# EAGLE design QC_MICRO_v0_2_without_teardrop (EAGLE 5.10)
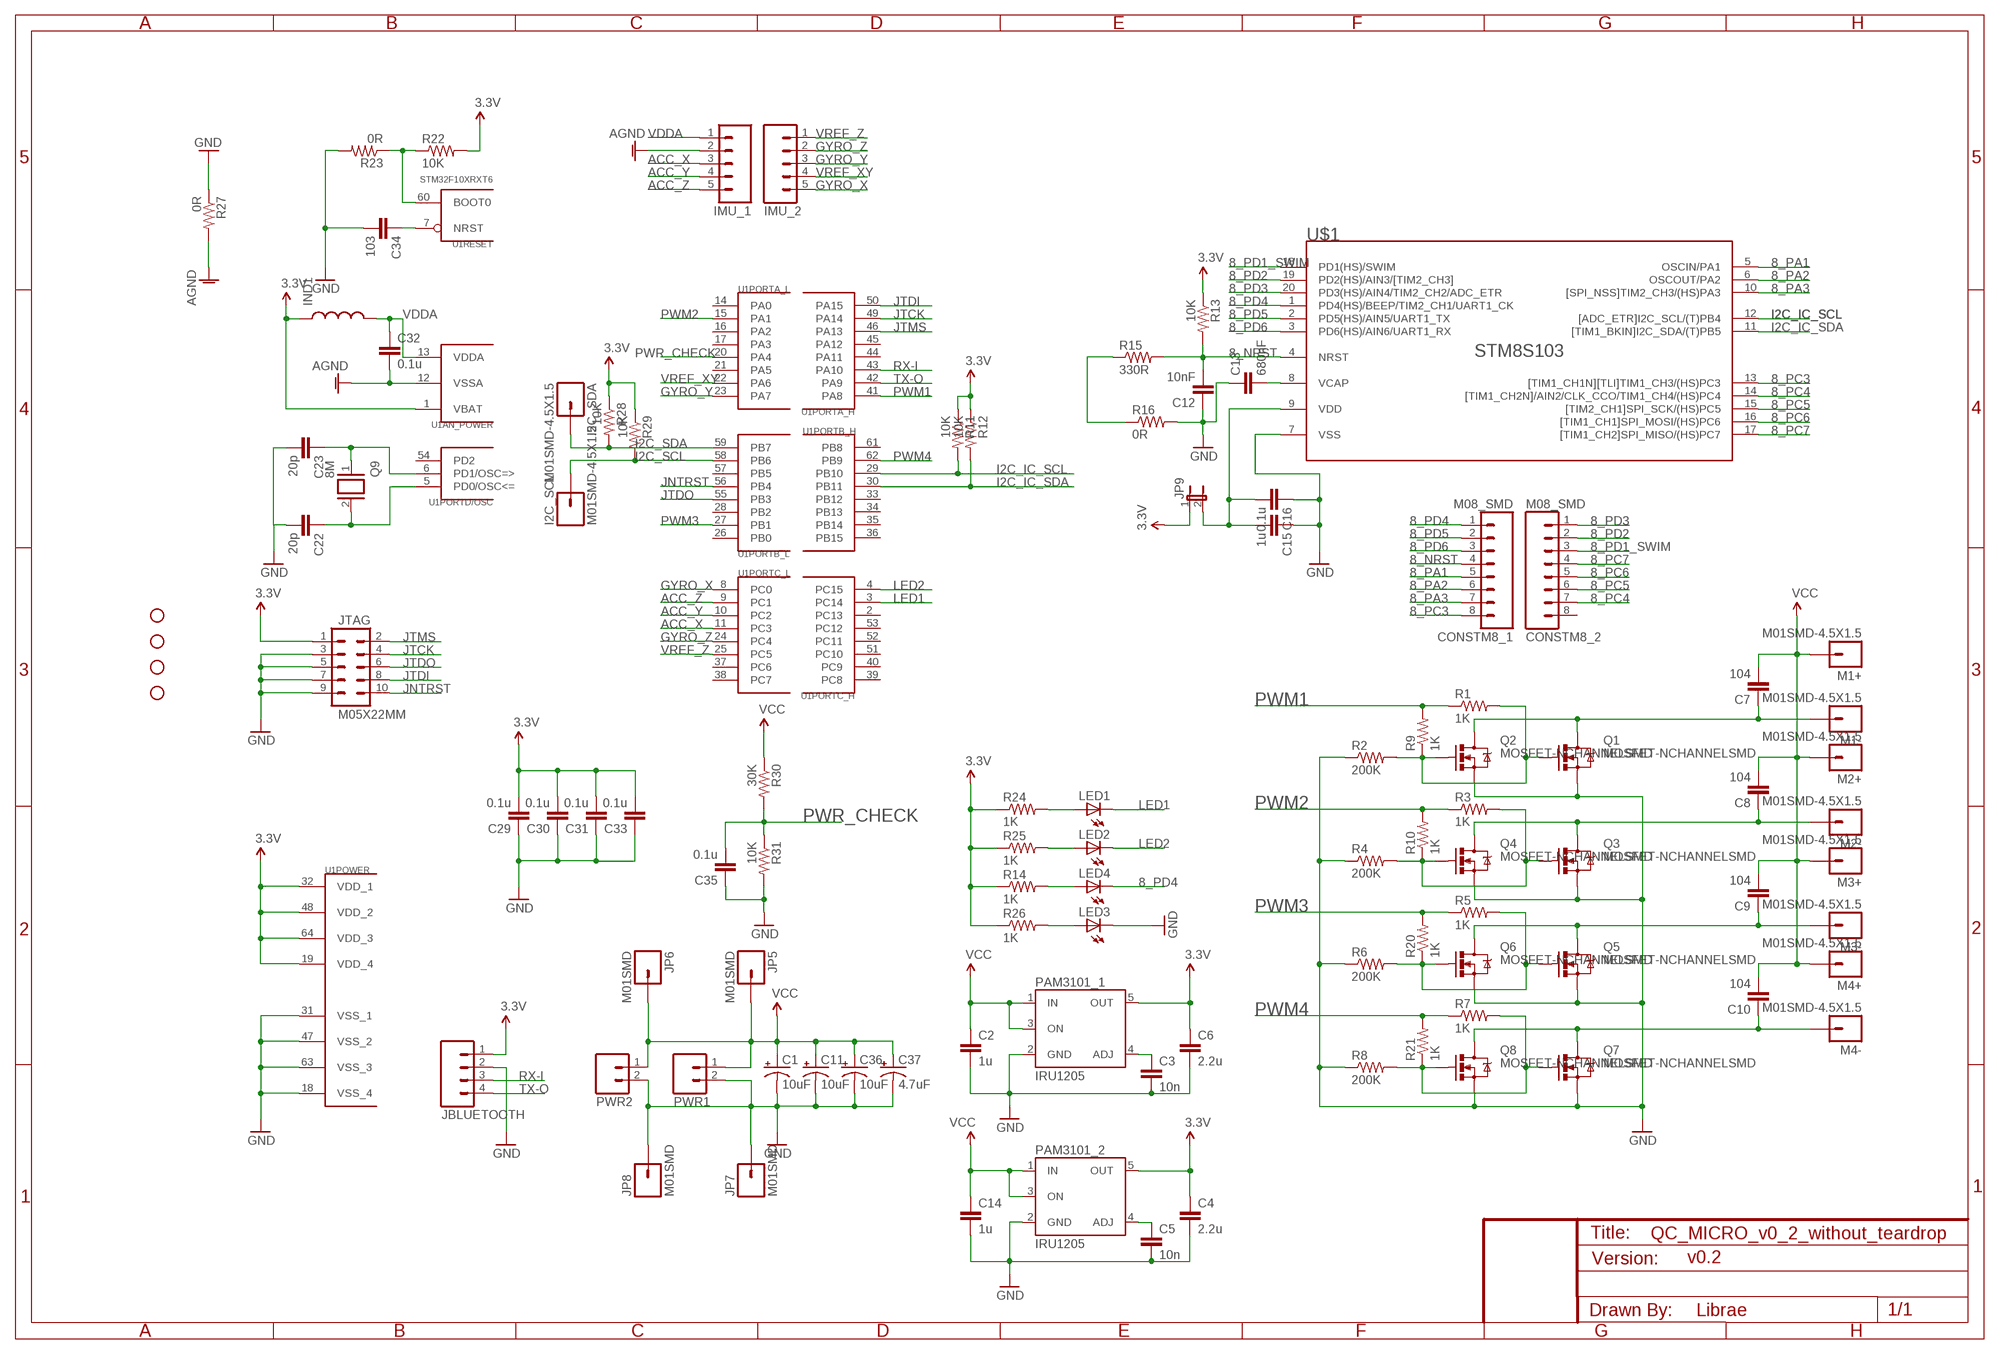
[diagram p0: schematic, sheet 1]

## Parts
C1  10uF  CAP_POL3528  [EIA3528]
C2  1u  CAP0603-CAP  [0603-CAP]
C3  10n  CAP0603-CAP  [0603-CAP]
C4  2.2u  CAP0603-CAP  [0603-CAP]
C5  10n  CAP0603-CAP  [0603-CAP]
C6  2.2u  CAP0603-CAP  [0603-CAP]
C7  104  CAP0603-CAP  [0603-CAP]
C8  104  CAP0603-CAP  [0603-CAP]
C9  104  CAP0603-CAP  [0603-CAP]
C10  104  CAP0603-CAP  [0603-CAP]
C11  10uF  CAP_POL3528  [EIA3528]
C12  10nF  CAP0603-CAP  [0603-CAP]
C13  680nF  CAP0603-CAP  [0603-CAP]
C14  1u  CAP0603-CAP  [0603-CAP]
C15  1u  CAP0805  [0805]
C16  0.1u  CAP0603-CAP  [0603-CAP]
C22  20p  CAP0603-CAP  [0603-CAP]
C23  20p  CAP0603-CAP  [0603-CAP]
C29  0.1u  CAP0603-CAP  [0603-CAP]
C30  0.1u  CAP0603-CAP  [0603-CAP]
C31  0.1u  CAP0603-CAP  [0603-CAP]
C32  0.1u  CAP0603-CAP  [0603-CAP]
C33  0.1u  CAP0603-CAP  [0603-CAP]
C34  103  CAP0603-CAP  [0603-CAP]
C35  0.1u  CAP0603-CAP  [0603-CAP]
C36  10uF  CAP_POL3528  [EIA3528]
C37  4.7uF  CAP_POL1206  [EIA3216]
CONSTM8_1  M08_SMD  [1X08_2MM_SMD]
CONSTM8_2  M08_SMD  [1X08_2MM_SMD]
I2C_SCL  M01SMD-4.5X1.5  [PAD-1.5X4.5]
I2C_SDA  M01SMD-4.5X1.5  [PAD-1.5X4.5]
IMU_1  M05PTH  [1X05]
IMU_2  M05PTH  [1X05]
IND1  INDUCTOR0603  [0603]
JBLUETOOTH  M04SMD  [1X04-SMD]
JP1  STAND-OFF  [STAND-OFF]
JP2  STAND-OFF  [STAND-OFF]
JP3  STAND-OFF  [STAND-OFF]
JP4  STAND-OFF  [STAND-OFF]
JP5  M01SMD  [LUXEON-PAD]
JP6  M01SMD  [LUXEON-PAD]
JP7  M01SMD  [LUXEON-PAD]
JP8  M01SMD  [LUXEON-PAD]
JP9  JUMPER-2SMD-NC  [SJ_2S]
JTAG  M05X22MM  [1X10-2MM]
LED1  LED0603  [LED-0603]
LED2  LED0603  [LED-0603]
LED3  LED0603  [LED-0603]
LED4  LED0603  [LED-0603]
M1+  M01SMD-4.5X1.5  [PAD-1.5X4.5]
M1-  M01SMD-4.5X1.5  [PAD-1.5X4.5]
M2+  M01SMD-4.5X1.5  [PAD-1.5X4.5]
M2-  M01SMD-4.5X1.5  [PAD-1.5X4.5]
M3+  M01SMD-4.5X1.5  [PAD-1.5X4.5]
M3-  M01SMD-4.5X1.5  [PAD-1.5X4.5]
M4+  M01SMD-4.5X1.5  [PAD-1.5X4.5]
M4-  M01SMD-4.5X1.5  [PAD-1.5X4.5]
PAM3101_1  IRU1205  [SOT23-5]
PAM3101_2  IRU1205  [SOT23-5]
PWR1  M023.5MM  [SCREWTERMINAL-3.5MM-2]
PWR2  M023.5MM  [SCREWTERMINAL-3.5MM-2]
Q1  MOSFET-NCHANNELSMD  [SOT23-3]
Q2  MOSFET-NCHANNELSMD  [SOT23-3]
Q3  MOSFET-NCHANNELSMD  [SOT23-3]
Q4  MOSFET-NCHANNELSMD  [SOT23-3]
Q5  MOSFET-NCHANNELSMD  [SOT23-3]
Q6  MOSFET-NCHANNELSMD  [SOT23-3]
Q7  MOSFET-NCHANNELSMD  [SOT23-3]
Q8  MOSFET-NCHANNELSMD  [SOT23-3]
Q9  8M  XTAL/S  [QS]
R1  1K  RESISTOR0603-RES  [0603-RES]
R2  200K  RESISTOR0603-RES  [0603-RES]
R3  1K  RESISTOR0603-RES  [0603-RES]
R4  200K  RESISTOR0603-RES  [0603-RES]
R5  1K  RESISTOR0603-RES  [0603-RES]
R6  200K  RESISTOR0603-RES  [0603-RES]
R7  1K  RESISTOR0603-RES  [0603-RES]
R8  200K  RESISTOR0603-RES  [0603-RES]
R9  1K  RESISTOR0603-RES  [0603-RES]
R10  1K  RESISTOR0603-RES  [0603-RES]
R11  10K  RESISTOR0603-RES  [0603-RES]
R12  10K  RESISTOR0603-RES  [0603-RES]
R13  10K  RESISTOR0603-RES  [0603-RES]
R14  1K  RESISTOR0603-RES  [0603-RES]
R15  330R  RESISTOR0603-RES  [0603-RES]
R16  0R  RESISTOR0603-RES  [0603-RES]
R20  1K  RESISTOR0603-RES  [0603-RES]
R21  1K  RESISTOR0603-RES  [0603-RES]
R22  10K  RESISTOR0603-RES  [0603-RES]
R23  0R  RESISTOR0603-RES  [0603-RES]
R24  1K  RESISTOR0603-RES  [0603-RES]
R25  1K  RESISTOR0603-RES  [0603-RES]
R26  1K  RESISTOR0603-RES  [0603-RES]
R27  0R  RESISTOR0603-RES  [0603-RES]
R28  10K  RESISTOR0603-RES  [0603-RES]
R29  10K  RESISTOR0603-RES  [0603-RES]
R30  30K  RESISTOR0603-RES  [0603-RES]
R31  10K  RESISTOR0603-RES  [0603-RES]
U1  STM32F10XRXT6  [TQFP64]
U$1  STM8SF103  [TSSOP20]

## Nets
3.3V: C4.1 C6.1 C29.2 C30.2 C31.2 C33.2 IND1.1 JBLUETOOTH.1 JP9.1 JTAG.1 PAM3101_1.5(OUT) PAM3101_2.5(OUT) R11.1 R12.1 R13.1 R14.1 R22.2 R24.1 R25.1 R26.1 R28.1 R29.1 U1.1(AN_POWER:VBAT) U1.19(POWER:VDD_4) U1.32(POWER:VDD_1) U1.48(POWER:VDD_2) U1.64(POWER:VDD_3)
8_NRST: C12.2 CONSTM8_1.4 R13.2 R15.2 U$1.4(NRST)
8_PA1: CONSTM8_1.5 U$1.5(OSCIN/PA1)
8_PA2: CONSTM8_1.6 U$1.6(OSCOUT/PA2)
8_PA3: CONSTM8_1.7 U$1.10([SPI_NSS]TIM2_CH3/(HS)PA3)
8_PC3: CONSTM8_1.8 U$1.13([TIM1_CH1N][TLI]TIM1_CH3/(HS)PC3)
8_PC4: CONSTM8_2.7 U$1.14([TIM1_CH2N]/AIN2/CLK_CCO/TIM1_CH4/(HS)PC4)
8_PC5: CONSTM8_2.6 U$1.15([TIM2_CH1]SPI_SCK/(HS)PC5)
8_PC6: CONSTM8_2.5 U$1.16([TIM1_CH1]SPI_MOSI/(HS)PC6)
8_PC7: CONSTM8_2.4 U$1.17([TIM1_CH2]SPI_MISO/(HS)PC7)
8_PD1_SWIM: CONSTM8_2.3 U$1.18(PD1(HS)/SWIM)
8_PD2: CONSTM8_2.2 U$1.19(PD2(HS)/AIN3/[TIM2_CH3])
8_PD3: CONSTM8_2.1 U$1.20(PD3(HS)/AIN4/TIM2_CH2/ADC_ETR)
8_PD4: CONSTM8_1.1 LED4.C U$1.1(PD4(HS)/BEEP/TIM2_CH1/UART1_CK)
8_PD5: CONSTM8_1.2 U$1.2(PD5(HS)/AIN5/UART1_TX)
8_PD6: CONSTM8_1.3 U$1.3(PD6(HS)/AIN6/UART1_RX)
ACC_X: IMU_1.3 U1.11(PORTC_L:PC3)
ACC_Y: IMU_1.4 U1.10(PORTC_L:PC2)
ACC_Z: IMU_1.5 U1.9(PORTC_L:PC1)
AGND: C32.2 IMU_1.2 R27.2 U1.12(AN_POWER:VSSA)
GND: C1.C(-) C2.2 C3.2 C4.2 C5.2 C6.2 C11.C(-) C12.1 C13.1 C14.2 C15.1 C16.1 C22.2 C23.2 C29.1 C30.1 C31.1 C33.1 C34.2 C35.1 C36.C(-) C37.C(-) JBLUETOOTH.2 JP7.P$1 JP8.P$1 JTAG.3 JTAG.5 JTAG.7 JTAG.9 LED3.C PAM3101_1.2(GND) PAM3101_2.2(GND) PWR1.2 PWR2.2 Q1.2(S) Q2.2(S) Q3.2(S) Q4.2(S) Q5.2(S) Q6.2(S) Q7.2(S) Q8.2(S) R2.1 R4.1 R6.1 R8.1 R16.2 R23.2 R27.1 R31.2 U1.18(POWER:VSS_4) U1.31(POWER:VSS_1) U1.47(POWER:VSS_2) U1.63(POWER:VSS_3) U$1.7(VSS)
GYRO_X: IMU_2.5 U1.8(PORTC_L:PC0)
GYRO_Y: IMU_2.3 U1.23(PORTA_L:PA7)
GYRO_Z: IMU_2.2 U1.24(PORTC_L:PC4)
I2C_IC_SCL: R11.2 U1.29(PORTB_H:PB10) U$1.12([ADC_ETR]I2C_SCL/(T)PB4)
I2C_IC_SDA: R12.2 U1.30(PORTB_H:PB11) U$1.11([TIM1_BKIN]I2C_SDA/(T)PB5)
I2C_SCL: I2C_SCL.P$1 R29.2 U1.58(PORTB_L:PB6)
I2C_SDA: I2C_SDA.P$1 R28.2 U1.59(PORTB_L:PB7)
JNTRST: JTAG.10 U1.56(PORTB_L:PB4)
JTCK: JTAG.4 U1.49(PORTA_H:PA14)
JTDI: JTAG.8 U1.50(PORTA_H:PA15)
JTDO: JTAG.6 U1.55(PORTB_L:PB3)
JTMS: JTAG.2 U1.46(PORTA_H:PA13)
LED1: LED1.C U1.3(PORTC_H:PC14)
LED2: LED2.C U1.4(PORTC_H:PC15)
N$1: C7.1 M1-.P$1 Q1.3(D) Q2.3(D)
N$2: C8.1 M2-.P$1 Q3.3(D) Q4.3(D)
N$3: C9.1 M3-.P$1 Q5.3(D) Q6.3(D)
N$4: C10.1 M4-.P$1 Q7.3(D) Q8.3(D)
N$5: Q3.1(G) Q4.1(G) R3.2 R4.2 R10.1
N$6: Q5.1(G) Q6.1(G) R5.2 R6.2 R20.1
N$7: Q7.1(G) Q8.1(G) R7.2 R8.2 R21.1
N$8: Q1.1(G) Q2.1(G) R1.2 R2.2 R9.1
N$9: C3.1 PAM3101_1.4(ADJ)
N$10: C23.1 Q9.1 U1.6(PORTD/OSC:PD1/OSC=>)
N$11: C34.1 U1.7(RESET:NRST)
N$12: R22.1 R23.1 U1.60(RESET:BOOT0)
N$13: LED1.A R24.2
N$14: C5.1 PAM3101_2.4(ADJ)
N$15: C22.1 Q9.2 U1.5(PORTD/OSC:PD0/OSC<=)
N$16: LED2.A R25.2
N$17: LED3.A R26.2
N$18: LED4.A R14.2
N$19: C13.2 U$1.8(VCAP)
N$20: C15.2 C16.2 JP9.2 U$1.9(VDD)
N$21: R15.1 R16.1
PWM1: R1.1 R9.2 U1.41(PORTA_H:PA8)
PWM2: R3.1 R10.2 U1.15(PORTA_L:PA1)
PWM3: R5.1 R20.2 U1.27(PORTB_L:PB1)
PWM4: R7.1 R21.2 U1.62(PORTB_H:PB9)
PWR_CHECK: C35.2 R30.2 R31.1 U1.20(PORTA_L:PA4)
RX-I: JBLUETOOTH.3 U1.43(PORTA_H:PA10)
TX-O: JBLUETOOTH.4 U1.42(PORTA_H:PA9)
VCC: C1.A(+) C2.1 C7.2 C8.2 C9.2 C10.2 C11.A(+) C14.1 C36.A(+) C37.A(+) JP5.P$1 JP6.P$1 M1+.P$1 M2+.P$1 M3+.P$1 M4+.P$1 PAM3101_1.1(IN) PAM3101_1.3(ON) PAM3101_2.1(IN) PAM3101_2.3(ON) PWR1.1 PWR2.1 R30.1
VDDA: C32.1 IMU_1.1 IND1.2 U1.13(AN_POWER:VDDA)
VREF_XY: IMU_2.4 U1.22(PORTA_L:PA6)
VREF_Z: IMU_2.1 U1.25(PORTC_L:PC5)
Unconnected: CONSTM8_2.8 U1.2(PORTC_H:PC13) U1.14(PORTA_L:PA0) U1.16(PORTA_L:PA2) U1.17(PORTA_L:PA3) U1.21(PORTA_L:PA5) U1.26(PORTB_L:PB0) U1.28(PORTB_L:PB2) U1.33(PORTB_H:PB12) U1.34(PORTB_H:PB13) U1.35(PORTB_H:PB14) U1.36(PORTB_H:PB15) U1.37(PORTC_L:PC6) U1.38(PORTC_L:PC7) U1.39(PORTC_H:PC8) U1.40(PORTC_H:PC9) U1.44(PORTA_H:PA11) U1.45(PORTA_H:PA12) U1.51(PORTC_H:PC10) U1.52(PORTC_H:PC11) U1.53(PORTC_H:PC12) U1.54(PORTD/OSC:PD2) U1.57(PORTB_L:PB5) U1.61(PORTB_H:PB8)

## Notes on the sheet
- v0.2
- Librae

## Library data of the parts
C1 C11 C36 C37 = SparkFun:CAP_POL: Capacitor Polarized These are standard SMD and PTH capacitors. Normally 10uF, 47uF, and 100uF in electrolytic and tantalum varieties. Always verify the external diameter of the through hole cap, it varies with capacity, voltage, and manufacturer. The EIA devices should be standard.
C2-C10 C12-C16 C22 C23 C29-C35 = SparkFun:CAP: Capacitor Standard 0603 ceramic capacitor, and 0.1" leaded capacitor.
CONSTM8_1 CONSTM8_2 = MyLib:M08_SMD
I2C_SCL I2C_SDA JP5-JP8 M1+ M1- M2+ M2- M3+ M3- M4+ M4- = SparkFun:M01: Header 1 Standard 1-pin 0.1" header. Use with straight break away headers (SKU : PRT-00116), right angle break away headers (PRT-00553), swiss pins (PRT-00743), machine pins (PRT-00117), and female headers (PRT-00115).
IMU_1 IMU_2 = SparkFun:M05: Header 5 Standard 5-pin 0.1" header. Use with straight break away headers (SKU : PRT-00116), right angle break away headers (PRT-00553), swiss pins (PRT-00743), machine pins (PRT-00117), and female headers (PRT-00115). Molex polarized connector foot print use with SKU : PRT-08230 with associated crimp pins and housings.
IND1 = SparkFun:INDUCTOR: Inductors Basic Inductor/Choke - 0603 and 1206. Footprints are not proven and vary greatly between part numbers.
JBLUETOOTH = MyLib:M04: Header 4 Standard 4-pin 0.1" header. Use with straight break away headers (SKU : PRT-00116), right angle break away headers (PRT-00553), swiss pins (PRT-00743), machine pins (PRT-00117), and female headers (PRT-00115). Molex polarized connector foot print use with SKU : PRT-08231 with associated crimp pins and housings.
JP1-JP4 = SparkFun:STAND-OFF: Stand Off This is the mechanical footprint for a #4 phillips button head screw. Use the keepout ring to avoid running the screw head into surrounding components. SKU : PRT-00447
JP9 = SparkFun:JUMPER-2: Jumper Basic 0.1" spaced jumper. Use with breakaway headers.
JTAG = MyLib:M05X2: Header 5x2 Standard 10-pin dual row 0.1" header. Commonly used with AVR-ISP. Use with Spark Fun Electronics SKU: PRT-00778
LED1-LED4 = SparkFun:LED: LEDs Standard schematic elements and footprints for 5mm, 3mm, 1206, and 0603 sized LEDs. 5mm - Spark Fun Electronics SKU : COM-00529 (and others)
PAM3101_1 PAM3101_2 = v-reg-3:IRU1205: Ultra low dropout positive regulator, 300mA, enable input
PWR1 PWR2 = SparkFun:M02: Header 2 Standard 2-pin 0.1" header. Use with straight break away headers (SKU : PRT-00116), right angle break away headers (PRT-00553), swiss pins (PRT-00743), machine pins (PRT-00117), and female headers (PRT-00115). Molex polarized connector foot print use with SKU : PRT-08233 with associated crimp pins and housings.
Q1-Q8 = SparkFun:MOSFET-NCHANNEL
Q9 = special:XTAL/S: CRYSTAL
R1-R16 R20-R31 = SparkFun:RESISTOR: Resistor Basic schematic elements and footprints for 0603, 1206, and PTH 1/10th watt (small) resistors.
U1 = stm32:STM32F10XRXT6: STM32F101/103 64pin LQFP
U$1 = MyLib:STM8SF103: STM8S103xx TSSOP20

## Board
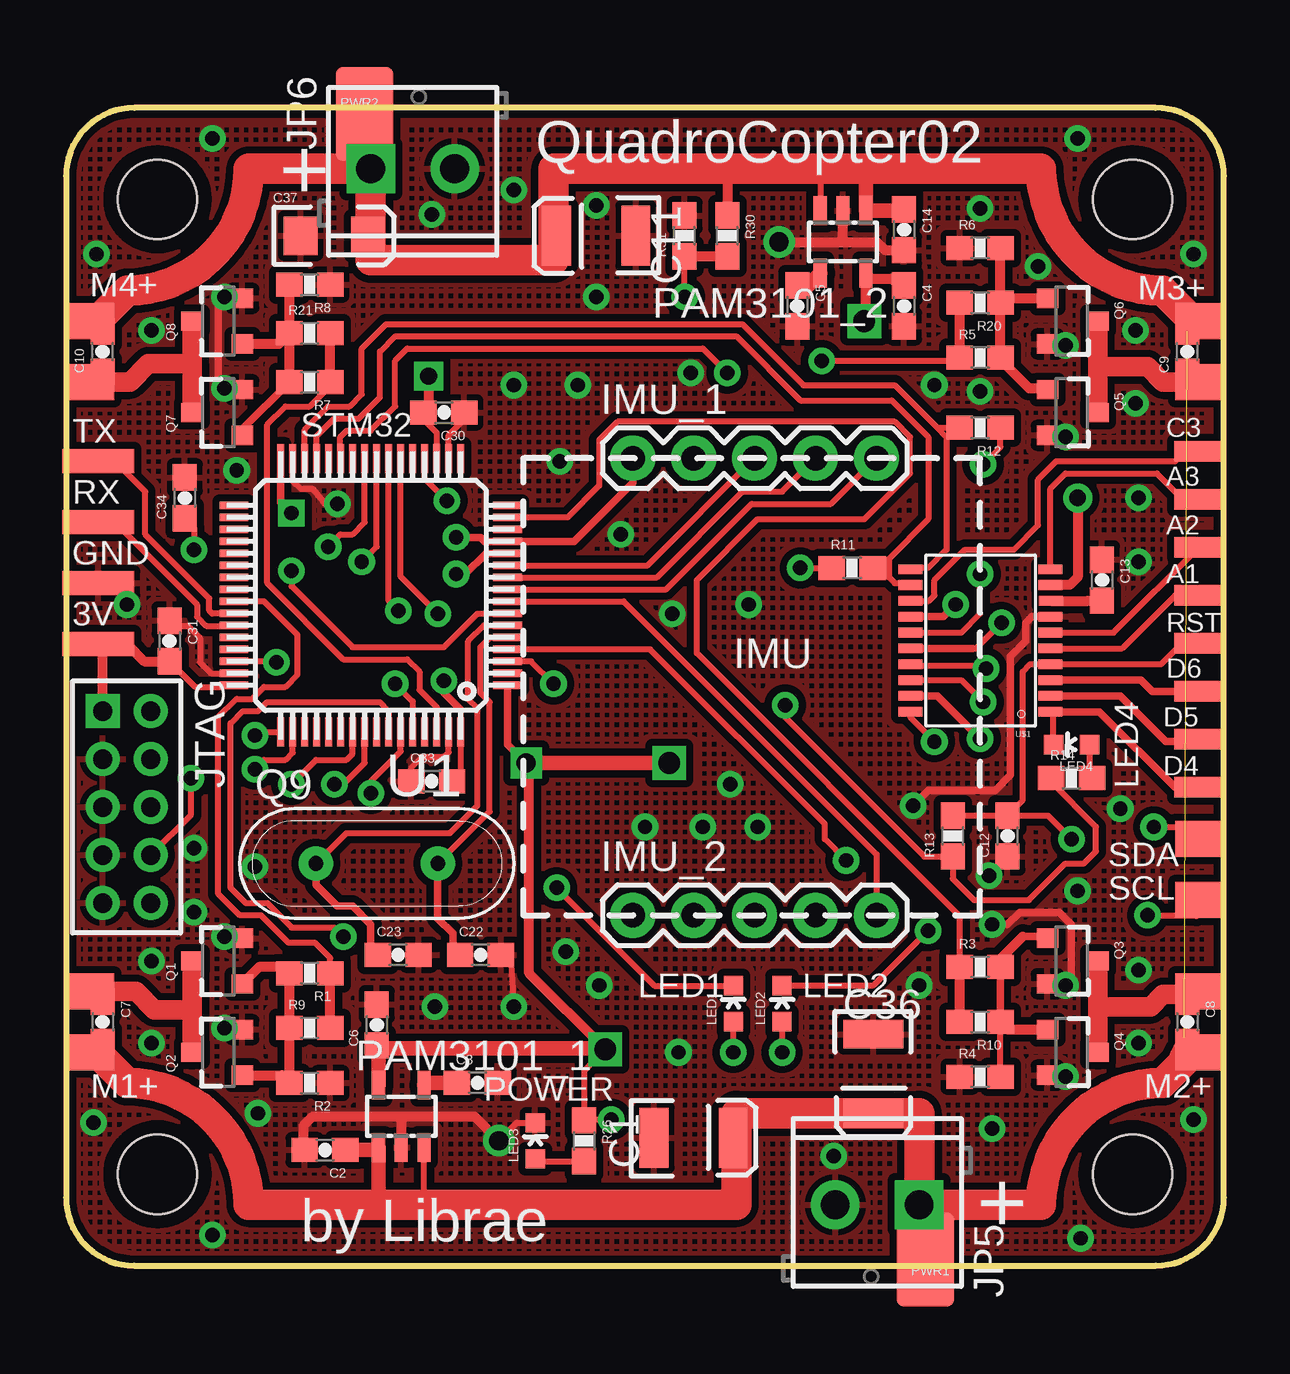
[diagram p1: board, top side]
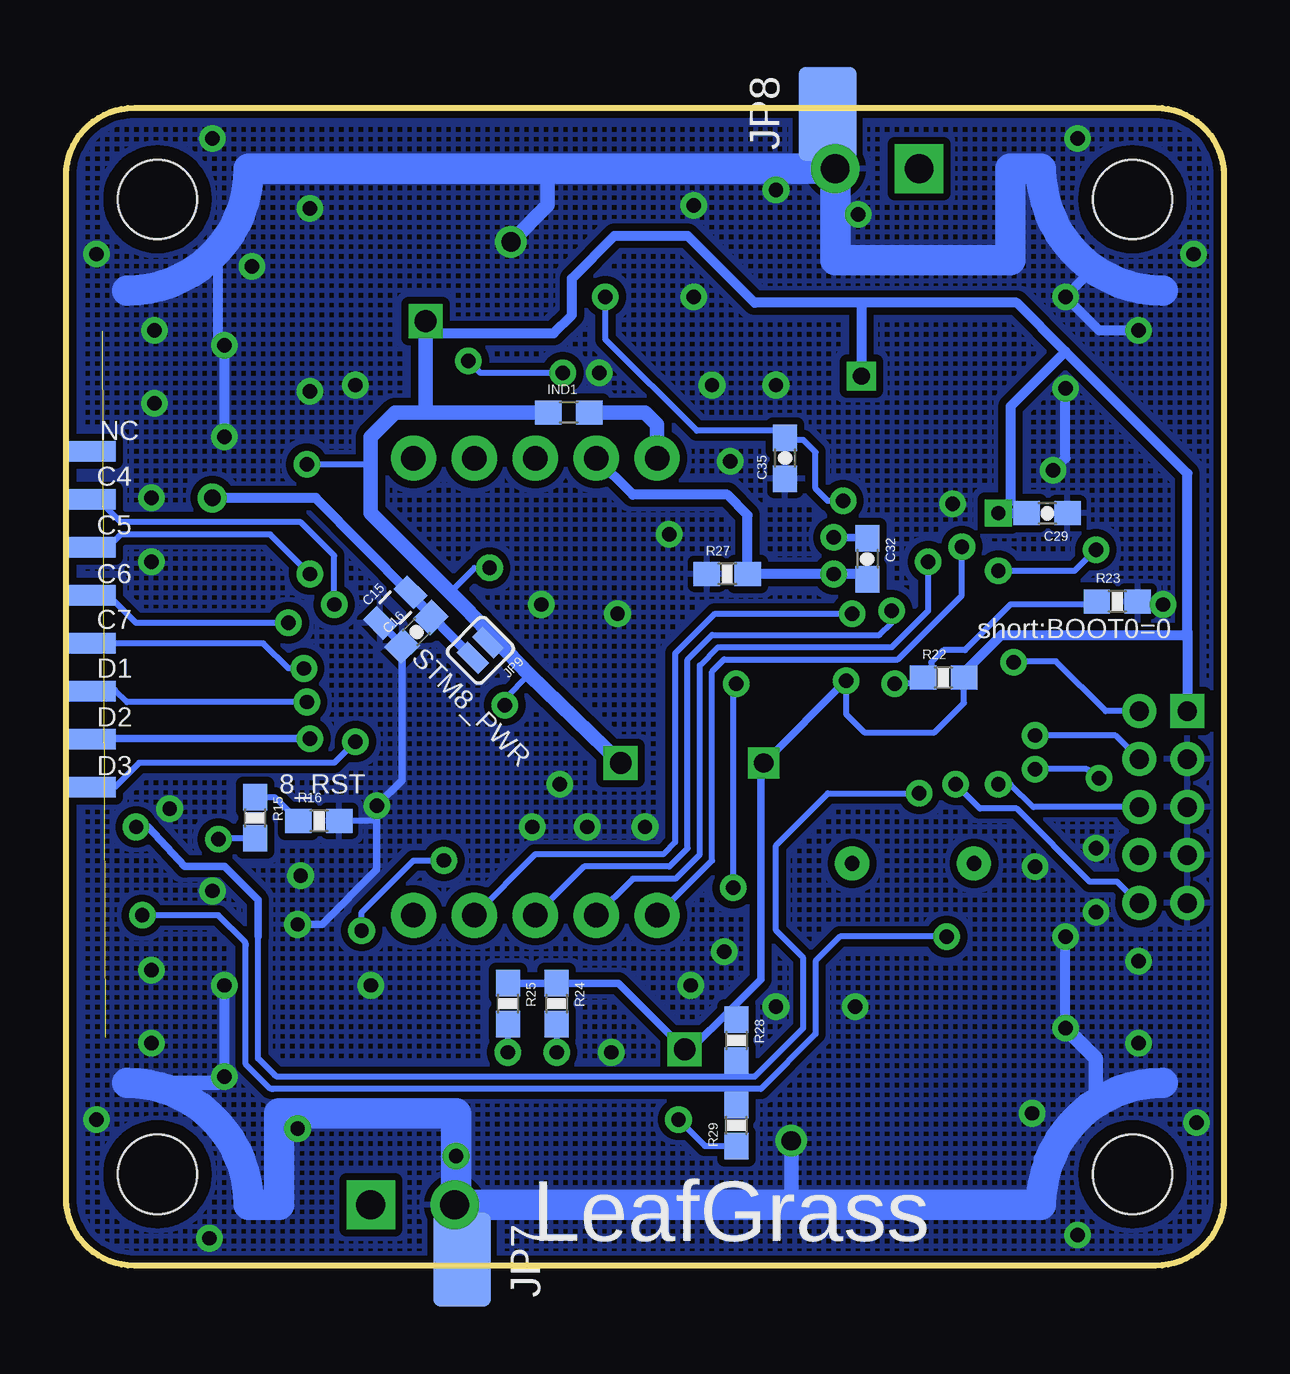
[diagram p2: board, bottom side, seen from below]

Size 48.26 x 48.26 mm. Coordinates in mm from the lower left corner, seen from the top.
Outline: 0,2.84 arc90 2.84,0 45.42,0 arc90 48.26,2.84 48.26,45.42 arc90 45.42,48.26 2.84,48.26 arc90 0,45.42 0,2.84
Copper layers (1*16): Top 0.035mm / dielectric 1.5mm / Bottom 0.035mm
Design rules "SparkFun": minimum track width 8mil, minimum drill 20mil, track to track 8mil, track to pad 8mil, pad to pad 8mil, via to via 8mil, smd to smd 8mil, copper to edge 10mil, drill to drill 8mil, minimum pad ring 12mil, minimum via ring 10mil, stop-mask expansion 4mil, vias tented up to drill 25mil, thermal gap 10mil

### Footprints (pad centres in the part's own frame; a part is rotated, then mirrored left to right if it is on the bottom)
EIA3528 = smd 1.2 x 2.5: A 1.65,0; C -1.65,0
0603-CAP = smd 1.1 x 1: 1 -0.85,0; 2 0.85,0
0805 = smd 0.8 x 1.2: 1 -0.9,0; 2 0.9,0
EIA3216 = smd 1.4 x 1.6: A 1.4,0; C -1.4,0
1X08_2MM_SMD = smd 0.85 x 2.1: 1 0.508,1.143; 2 2.508,1.143; 3 4.508,1.143; 4 6.508,1.143; 5 8.508,1.143; 6 10.508,1.143; 7 12.508,1.143; 8 14.508,1.143
PAD-1.5X4.5 = smd 1.5 x 2: P$1 0,0
1X05 = drill 1.016 pad 1.88 round: 1 0,0; 2 2.54,0; 3 5.08,0; 4 7.62,0; 5 10.16,0
0603 = smd 1.1 x 1: 1 -0.85,0; 2 0.85,0
1X04-SMD = smd 1 x 3: 1 -3.81,-0.08; 2 -1.27,-0.08; 3 1.27,-0.08; 4 3.81,-0.08
STAND-OFF = hole 3.302: 0,0
LUXEON-PAD = smd 3.9 x 2.4: P$1 0,0
SJ_2S = smd 0.635 x 1.27: 1 -0.45,0; 2 0.45,0
1X10-2MM = drill 0.8 square: 1 0,0 | drill 0.8 round: 2 0,2; 3 2,0; 4 2,2; 5 4,0; 6 4,2; 7 6,0; 8 6,2; 9 8,0; 10 8,2
LED-0603 = smd 0.8 x 0.8: A 0,-0.75; C 0,0.75
SOT23-5 = smd 0.55 x 1.2: 1 -0.95,-1.3; 2 0,-1.3; 3 0.95,-1.3; 4 0.95,1.3; 5 -0.95,1.3
SCREWTERMINAL-3.5MM-2 = drill 1.2 pad 2.032 square: 1 0,0 | drill 1.2 pad 2.032 round: 2 3.5,0
SOT23-3 = smd 0.8 x 0.9: 1 -0.95,-1; 2 0.95,-1; 3 0,1.1
QS = drill 0.61 pad 1.422 round: 1 -2.54,0; 2 2.54,0
0603-RES = smd 1.1 x 1: 1 -0.85,0; 2 0.85,0
TQFP64 = smd 1.2 x 0.3: 1 -5.7,3.75; 2 -5.7,3.25; 3 -5.7,2.75; 4 -5.7,2.25; 5 -5.7,1.75; 6 -5.7,1.25; 7 -5.7,0.75; 8 -5.7,0.25; 9 -5.7,-0.25; 10 -5.7,-0.75; 11 -5.7,-1.25; 12 -5.7,-1.75; 13 -5.7,-2.25; 14 -5.7,-2.75; 15 -5.7,-3.25; 16 -5.7,-3.75; 33 5.7,-3.75; 34 5.7,-3.25; 35 5.7,-2.75; 36 5.7,-2.25; 37 5.7,-1.75; 38 5.7,-1.25; 39 5.7,-0.75; 40 5.7,-0.25; 41 5.7,0.25; 42 5.7,0.75; 43 5.7,1.25; 44 5.7,1.75; 45 5.7,2.25; 46 5.7,2.75; 47 5.7,3.25; 48 5.7,3.75 | smd 0.3 x 1.2: 17 -3.75,-5.7; 18 -3.25,-5.7; 19 -2.75,-5.7; 20 -2.25,-5.7; 21 -1.75,-5.7; 22 -1.25,-5.7; 23 -0.75,-5.7; 24 -0.25,-5.7; 25 0.25,-5.7; 26 0.75,-5.7; 27 1.25,-5.7; 28 1.75,-5.7; 29 2.25,-5.7; 30 2.75,-5.7; 31 3.25,-5.7; 32 3.75,-5.7; 49 3.75,5.7; 50 3.25,5.7; 51 2.75,5.7; 52 2.25,5.7; 53 1.75,5.7; 54 1.25,5.7; 55 0.75,5.7; 56 0.25,5.7; 57 -0.25,5.7; 58 -0.75,5.7; 59 -1.25,5.7; 60 -1.75,5.7; 61 -2.25,5.7; 62 -2.75,5.7; 63 -3.25,5.7; 64 -3.75,5.7
TSSOP20 = smd 1 x 0.4: 1 -2.937,2.693; 2 -2.937,2.032; 3 -2.937,1.372; 4 -2.937,0.712; 5 -2.937,0.051; 6 -2.937,-0.609; 7 -2.937,-1.27; 8 -2.943,-1.93; 9 -2.937,-2.59; 10 -2.937,-3.251; 11 2.905,-3.251; 12 2.905,-2.59; 13 2.911,-1.93; 14 2.905,-1.27; 15 2.905,-0.609; 16 2.905,0.051; 17 2.905,0.712; 18 2.905,1.372; 19 2.905,2.032; 20 2.905,2.693

### Placement (x,y rotation side)
C1  26.16,5.33 0 top
C2  10.79,4.83 180 top
C3  17.14,7.62 0 top
C4  34.92,40.01 270 top
C5  30.48,40.01 270 top
C6  12.95,10.03 90 top
C7  1.52,10.16 270 top
C8  46.74,10.16 270 top
C9  46.74,38.1 90 top
C10  1.52,38.1 90 top
C11  22.1,42.93 180 top
C12  39.24,17.91 90 top
C13  43.18,28.57 270 top
C14  34.92,43.18 270 top
C15  34.54,27.43 45 bottom
C16  33.66,26.42 45 bottom
C22  17.27,12.95 0 top
C23  13.84,12.95 0 top
C29  7.37,31.37 180 bottom
C30  15.75,35.56 180 top
C31  4.32,26.04 270 top
C32  14.86,29.46 270 bottom
C33  15.24,20.19 0 top
C34  4.95,32 90 top
C35  18.29,33.66 90 bottom
C36  33.66,8 270 top
C37  11.18,42.93 0 top
CONSTM8_1  48.39,19.43 90 top
CONSTM8_2  46.1,19.43 90 bottom
I2C_SCL  47.24,15.24 90 top
I2C_SDA  47.24,17.78 90 top
IMU_1  23.62,33.66 0 top
IMU_2  23.62,14.61 0 top
IND1  27.3,35.56 0 bottom
JBLUETOOTH  1.27,29.72 90 top
JP1  3.81,3.81 0 top
JP2  44.45,3.81 0 top
JP3  44.45,44.45 0 top
JP4  3.81,44.45 0 top
JP5  35.81,0.25 270 top
JP6  12.45,48.01 90 top
JP7  31.75,0.25 270 bottom
JP8  16.51,48.01 90 bottom
JP9  30.99,25.65 225 bottom
JTAG  1.52,23.11 270 top
LED1  27.81,10.92 0 top
LED2  29.84,10.92 0 top
LED3  19.56,5.21 0 top
LED4  41.91,21.72 90 top
M1+  1.02,8.89 90 top
M1-  1.02,11.43 90 top
M2+  47.24,8.89 90 top
M2-  47.24,11.43 90 top
M3+  47.24,39.37 90 top
M3-  47.24,36.83 90 top
M4+  1.02,39.37 90 top
M4-  1.02,36.83 270 top
PAM3101_1  13.97,6.22 0 top
PAM3101_2  32.38,42.67 180 top
PWR1  35.56,2.54 180 top
PWR2  12.7,45.72 0 top
Q1  6.35,12.7 90 top
Q2  6.35,8.89 90 top
Q3  41.91,12.7 270 top
Q4  41.91,8.89 270 top
Q5  41.91,35.56 270 top
Q6  41.91,39.37 270 top
Q7  6.35,35.56 90 top
Q8  6.35,39.37 90 top
Q9  12.95,16.76 0 top
R1  10.16,12.19 180 top
R2  10.16,7.62 180 top
R3  38.1,12.45 0 top
R4  38.1,7.87 0 top
R5  38.1,37.85 0 top
R6  38.1,42.42 0 top
R7  10.16,36.83 180 top
R8  10.16,40.89 180 top
R9  10.16,9.91 0 top
R10  38.1,10.16 180 top
R11  32.77,29.08 0 top
R12  38.1,34.92 180 top
R13  36.96,17.91 90 top
R14  41.91,20.32 0 top
R15  40.39,18.67 270 bottom
R16  37.72,18.54 0 bottom
R20  38.1,40.13 180 top
R21  10.16,38.86 0 top
R22  11.68,24.51 0 bottom
R23  4.45,27.69 0 bottom
R24  27.81,10.92 270 bottom
R25  29.84,10.92 270 bottom
R26  21.59,5.21 270 top
R27  20.7,28.83 0 bottom
R28  20.32,9.4 270 bottom
R29  20.32,5.84 90 bottom
R30  27.56,42.93 270 top
R31  25.78,42.93 90 top
U1  12.7,27.94 180 top
U$1  38.1,25.78 180 top

### Tracks (layer width: path | path; a pad name or v marks a point on that pad's centre or on a via)
3.3V  (via drill 0.6, 0.7, 0.8, 0.9)
  Top 0.254: U1.19 15.45,34.72 14.86,35.31 | C30.2 14.86,35.73 | C33.2 16.45,20.19 U1.64 16.45,23.17 | v22.48,9.02 21.59,8.13 R26.1 21.63,6.1 v22.73,6.1 | C31.2 5.37,24.13 6.48,24.13 6.54,24.19 U1.48 | v30.61,29.08 R11.1 | R12.1 38.95,34.12 v38.23,33.4 | v29.97,23.37 29.97,22.86 35.77,17.06 R13.1 36.96,16.13 37.85,15.24 40.13,15.24 41.66,16.76 42.42,16.76 42.93,17.27 42.93,18.29 41.06,20.15 R14.1 41.02,20.32
  Top 0.305: 14.86,35.73 14.86,35.31 | 22.44,9.06 v22.48,9.02 | 16.45,23.17 15.75,23.88 v15.75,24.38 | U1.32 8.95,31.82 v9.4,31.37 | U1.1 18.4,21.73 v19.18,20.95
  Top 0.406: JTAG.1 1.52,25.73 JBLUETOOTH.1 2.54,25.91 3.26,25.18 C31.2 | 19.3,20.95 19.3,12.19 v22.48,9.02 | v33.27,39.37 33.34,39.43 PAM3101_2.5 33.56,41.15 34.42,41.15 34.71,40.85 C4.1 | v15.11,37.08 15.11,35.77 C30.2
  Top 0.61: 22.44,9.06 13.21,9.06 13.02,8.87 PAM3101_1.5 13.02,9.12 C6.1 | 19.3,20.95 v25.15,20.95
  Bottom 0.254: R22.2 10.83,23.46 12.06,22.23 14.99,22.23 15.75,22.99 v15.75,24.38 | R28.1 20.57,10.25 20.57,10.67 | v22.73,6.1 21.63,4.99 R29.1 | v30.61,29.08 31.24,29.08 32.26,28.07 | 35.69,33.4 v38.23,33.4 | v29.97,23.37 29.97,23.62 28.96,24.64
  Bottom 0.305: R25.1 R24.1 25.23,11.77 v22.48,9.02 22.23,9.02 20.57,10.67 19.3,11.94 19.3,20.83 v19.18,20.95 v15.75,24.38
  Bottom 0.406: 1.52,26.42 JTAG.1 | 1.52,26.42 1.52,33.02 6.6,38.1 | 6.6,38.1 8.64,40.13 15.11,40.13 | 15.11,40.13 19.56,40.13 22.35,42.93 25.4,42.93 27.18,41.15 27.18,39.62 27.94,38.86 32.77,38.86 v33.27,39.37 | R22.2 10.83,24.73 9.27,26.29 1.65,26.29 1.52,26.42 | 6.6,38.1 8.89,35.81 8.89,31.88 v9.4,31.37 C29.2 | 15.11,40.13 v15.11,37.08 | 35.56,33.53 35.69,33.4 | JP9.1 30.61,26.29 31.62,27.43
  Bottom 0.61: v25.15,20.95 28.96,24.64 31.62,27.43 32.26,28.07 35.56,31.37 35.56,33.53 35.56,34.54 34.54,35.56 33.27,35.56 | 33.27,35.56 v33.27,39.37 | 33.27,35.56 IND1.1
8_NRST  (via drill 0.6)
  Top 0.254: C12.2 39.88,19.39 39.88,24.77 40.18,25.07 U$1.4 45.64,25.07 46.48,25.91 47.21,25.91 CONSTM8_1.4 | R13.2 C12.2 | C12.2 40.93,18.76 v41.91,17.78
  Bottom 0.254: R15.2 41.87,17.82 v41.91,17.78
8_PA1
  Top 0.254: CONSTM8_1.5 46.23,27.94 44.02,25.73 U$1.5
8_PA2
  Top 0.254: U$1.6 43.66,26.39 47.21,29.94 CONSTM8_1.6
8_PA3
  Top 0.254: U$1.10 41.04,32.4 41.66,33.02 45.47,33.02 46.48,32 47.18,32 CONSTM8_1.7
8_PC3
  Top 0.254: 35.59,27.71 35.97,27.71 36.2,27.94 36.2,28.57 37.47,29.84 39.5,29.84 40.51,30.86 40.51,32.77 41.27,33.53 46.23,33.53 46.74,34.04 47.15,34.04 CONSTM8_1.8
  Top 0.305: U$1.13 35.59,27.71
8_PC4  (via drill 0.6)
  Top 0.305: U$1.14 36.58,27.05 v37.08,27.56
  Bottom 0.254: v37.08,27.56 37.08,29.59 38.48,30.99 45.97,30.99 46.55,31.56 46.55,31.94 CONSTM8_2.7 47.18,32 46.61,32
8_PC5  (via drill 0.6)
  Top 0.254: U$1.15 37.31,26.39 38.1,27.18 v38.1,28.83
  Bottom 0.254: v38.1,28.83 39.75,30.48 45.97,30.48 46.52,29.94 CONSTM8_2.6
8_PC6  (via drill 0.6)
  Top 0.254: 37.8,25.73 37.92,25.73 v38.99,26.8
  Top 0.305: U$1.16 37.8,25.73
  Bottom 0.254: v38.99,26.8 45.34,26.8 46.48,27.94 CONSTM8_2.5
8_PC7  (via drill 0.6)
  Top 0.254: 35.24,25.02 38.23,25.02 v38.35,24.89
  Top 0.305: U$1.17 35.24,25.02
  Bottom 0.254: CONSTM8_2.4 40.04,25.94 38.99,24.89 v38.35,24.89
8_PD1_SWIM  (via drill 0.6)
  Top 0.254: U$1.18 37.31,24.41 v38.23,23.5
  Bottom 0.254: v38.23,23.5 45.72,23.5 46.23,24 47.18,24 CONSTM8_2.3
  Bottom 0.305: CONSTM8_2.3 47.18,23.88
8_PD2  (via drill 0.6)
  Top 0.305: U$1.19 36.32,23.75 v38.1,21.97
  Bottom 0.305: v38.1,21.97 47.21,21.97 CONSTM8_2.2
8_PD3  (via drill 0.6)
  Top 0.254: U$1.20 35.2,22.84 v36.2,21.84
  Bottom 0.254: CONSTM8_2.1 46.23,19.94 45.21,20.95 37.08,20.95 v36.2,21.84
8_PD4
  Top 0.254: U$1.1 41.16,23.09 LED4.C
  Top 0.305: U$1.1 43.08,23.09 46.23,19.94 CONSTM8_1.1
8_PD5
  Top 0.305: U$1.2 43.94,23.75 45.85,21.84 47.15,21.84 CONSTM8_1.2
8_PD6
  Top 0.305: U$1.3 44.81,24.41 45.28,23.94 CONSTM8_1.3 47.18,23.88
ACC_X
  Top 0.254: U1.11 24.24,29.19 IMU_1.3
ACC_Y
  Top 0.254: U1.10 24.63,28.69 28.19,32.26 29.84,32.26 IMU_1.4
ACC_Z
  Top 0.254: U1.9 25.02,28.19 28.57,31.75 31.88,31.75 IMU_1.5
AGND  (via drill 0.6)
  Top 0.305: U1.12 17.5,29.69 16.64,28.83 v16.26,28.83
  Bottom 0.406: IMU_1.2 24.64,32.13 20.7,32.13 19.85,31.28 R27.2 v16.26,28.83 15.07,28.83 C32.2
GND  (via drill 0.6, 0.8)
  Top 0.254: C30.1 16.64,35.6 | U1.47 6.04,24.69 5.59,25.15 5.59,26.16 5.08,26.67 4.53,26.67 C31.1 | C33.1 14.39,20.74 14.86,21.21 15.75,21.21 15.95,21.41 U1.63 | U1.31 9.45,32.71 9.78,32.38 10.29,32.38 10.79,31.75 v11.3,31.75 | C22.2 18.54,12.95 v18.67,10.79 | U1.18 15.95,34.62 16.73,35.39 C30.1 | C30.1 16.76,35.69 | LED3.C 18.78,5.96 v18.03,5.21
  Top 0.305: 16.64,35.6 16.64,35.43 | U$1.7 40.26,27.05 40.01,26.8 40.01,26.04 39.37,25.4 39.37,20.45 38.73,19.81 35.94,19.81 v35.31,19.18 | v38.61,14.22 39.24,14.22 39.75,14.73 41.4,14.73 41.91,14.22 41.91,11.94 v41.66,11.68 | C12.1 39.24,17.02 v38.48,16.26 | v6.6,36.58 6.35,36.83 6.35,40.13 v6.6,40.39
  Top 0.406: 7.35,9.91 Q2.2 6.67,9.84 v6.6,9.91 | v6.6,13.72 6.67,13.65 Q1.2 | Q4.2 41.66,7.94 v41.66,7.87 | Q3.2 41.66,11.75 v41.66,11.68 | Q7.2 6.6,36.51 v6.6,36.58 | Q8.2 6.6,40.32 v6.6,40.39 | Q6.2 41.66,38.42 v41.66,38.35 | 13.97,6.22 17.02,6.22 v18.03,5.21 | 9.91,4.83 9.91,5.84 10.29,6.22 13.97,6.22 | 13.97,6.22 PAM3101_1.2 | C14.2 34.12,42.33 33.78,42.67 32.38,42.67 | 32.38,42.67 PAM3101_2.2 | v41.66,34.54 40.98,34.54 Q5.2 | v29.72,42.67 32.38,42.67
  Top 0.61: v18.03,5.21 18.03,5.28
  Bottom 0.254: R16.2 35.43,18.54 35.31,18.67
  Bottom 0.305: v38.61,14.22 37.59,14.22 35.31,16.51 35.31,18.67 v35.31,19.18 34.26,20.23 C16.1 34.26,25.87 C15.1
  Bottom 0.406: PWR2.2 16.51,45.72 JP8.P$1 | JP7.P$1 32.06,0.25 PWR1.2 | 41.66,7.94 v41.66,11.68 | v6.6,9.91 v6.6,13.72 | v41.66,34.54 v41.66,38.35 41.91,38.61 41.91,42.29 | v3.56,38.99 5.21,38.99 v6.6,40.39 5.46,41.53 5.46,41.66 4.45,40.64 2.54,40.64 | v6.6,36.58 6.6,33.66 v7.11,33.15
  Bottom 0.61: 41.66,7.94 v41.66,7.87 41.91,7.62 45.72,7.62 | 7.62,2.54 7.62,4.45 5.33,6.73 5.33,8.64 v6.6,9.91 | 28.19,45.72 28.19,44.2 v29.72,42.67 | v18.03,5.21 18.03,2.54
  Bottom 1.27: 2.54,7.62 arc-90 7.62,2.54 18.03,2.54 32,2.54 32,6.35 39.37,6.35 39.37,2.54 40.64,2.54 arc-90 45.72,7.62 | 2.54,40.64 arc90 7.62,45.72 8.89,45.72 8.89,41.91 16.2,41.91 PWR2.2 28.19,45.72 40.64,45.72 arc90 45.72,40.64
  Bottom 1.422: 32,2.54 PWR1.2
  other vias: 44.58,38.99 3.56,9.27 44.7,9.27 2.54,27.56 5.33,17.4 20.83,13.08 23.11,30.48 7.87,16.64 24.13,18.29 22.1,44.2 5.33,14.73 25.53,8.89 44.7,12.32 43.94,19.05 38.1,36.45 22.23,11.68 15.37,10.79 15.24,43.81 18.67,44.83 22.1,40.39 35.56,11.68 32,4.57 38.61,5.71 8,6.35 38.1,44.07 40.51,41.66 28.45,27.56 42.16,46.99 46.99,42.16 6.1,46.99 1.27,42.16 1.14,5.97 6.1,1.27 42.29,1.14 46.99,6.1 20.57,33.53 36.2,36.7 18.67,36.7 44.7,32 44.7,29.34 25.27,27.18 28.83,18.29 26.54,18.29 27.69,20.07 21.34,36.7 44.58,35.94 3.56,12.7 42.16,15.62 26.04,37.21
  pour Top (isolate 0.305, hatched): 0,1.27 0,46.99 arc-90 1.27,48.26 46.99,48.26 arc-90 48.26,46.99 48.26,1.27 arc-90 46.99,0 1.27,0 arc-90
  pour Bottom (isolate 0.305, hatched): 0,1.27 arc90 1.27,0 46.99,0 arc90 48.26,1.27 48.26,46.99 arc90 46.99,48.26 1.27,48.26 arc90 0,46.99
GYRO_X
  Top 0.254: U1.8 23.24,27.69 33.78,17.14 IMU_2.5
GYRO_Y  (via drill 0.6)
  Top 0.254: v13.84,27.3 13.45,27.7 U1.23
  Bottom 0.254: IMU_2.3 26.67,16.64 23.11,16.64 22.35,17.4 22.35,25.27 21.34,26.29 14.35,26.29 13.84,26.8 v13.84,27.3
GYRO_Z  (via drill 0.6)
  Top 0.254: v12.32,29.34 12.95,29.97 U1.24
  Bottom 0.254: v12.32,29.34 12.32,27.3 13.84,25.78 21.08,25.78 21.84,25.02 21.84,17.14 22.86,16.13 24.64,16.13 IMU_2.2
I2C_IC_SCL
  Top 0.254: U1.29 10.45,34.58 11.18,35.31 12.19,35.31 13.08,36.2 13.08,38.1 13.72,38.73 27.94,38.73 30.61,36.07 34.42,36.07 35.94,34.54 35.94,31.11 34.29,29.46 34.29,29.08 | U$1.12 35.12,28.45 34.54,28.45 34.29,28.7 34.29,28.96 34.29,29.08 | 34.29,29.08 R11.2
I2C_IC_SDA
  Top 0.254: U1.30 9.95,34.84 10.92,35.81 11.81,35.81 12.32,36.32 12.32,38.23 13.34,39.24 28.19,39.24 30.73,36.7 34.54,36.7 36.2,35.05 36.32,34.92 | 36.32,34.92 36.7,34.54 36.7,29.84 35.94,29.08 35.25,29.08 U$1.11 | 36.32,34.92 R12.2
I2C_SCL  (via drill 0.6)
  Top 0.254: U1.58 13.45,23.13 13.08,23.5 8.38,23.5 8,23.11 7.37,23.11 6.86,22.61 6.86,15.75 7.49,15.11 8.38,15.11 9.4,14.1 11.18,14.1 v11.56,13.72 | v45.09,14.61 47.12,14.61
  Top 0.305: I2C_SCL.P$1 47.12,15.11 47.12,14.61
  Bottom 0.254: v45.09,14.61 41.91,14.61 40.84,13.54 arc45 40.77,13.36 40.77,8.38 39.83,7.44 arc-45 39.65,7.37 20.45,7.37 | R29.2 20.45,6.69 20.45,7.37 | 20.45,7.37 19.3,7.37 17.02,9.65 17.02,12.7 16,13.72 v11.56,13.72
I2C_SDA  (via drill 0.6)
  Top 0.254: U1.59 13.95,21.44 12.7,20.19 v12.7,19.68 | v45.34,18.29 46.74,18.29
  Top 0.305: 46.74,18.29 I2C_SDA.P$1
  Bottom 0.254: v12.7,19.68 16.51,19.68 18.67,17.53 18.67,13.97 17.53,12.83 17.53,9.91 19.56,7.87 20.32,7.87 | 40.26,13.72 40.26,8.64 39.57,7.95 arc-45 39.39,7.87 20.32,7.87 | 44.83,18.29 v45.34,18.29 | 20.32,7.87 R28.2
  Bottom 0.305: 40.26,13.72 40.26,15.24 41.66,16.64 43.31,16.64 44.83,18.29
JNTRST  (via drill 0.6)
  Top 0.254: v11.18,20.07 11.56,20.07 12.45,20.95 U1.56
  Bottom 0.254: v11.18,20.07 10.16,19.05 8.64,19.05 5.59,16 4.45,16 3.56,15.11 JTAG.10
JTCK  (via drill 0.6)
  Top 0.254: v7.87,22.1 8.02,22.24 U1.49
  Bottom 0.254: JTAG.4 4.51,22.1 v7.87,22.1
JTDI  (via drill 0.6)
  Top 0.254: JTAG.8 5.21,18.8 v5.21,20.32 | U1.50 9.45,21.39 9.14,21.08 8.26,21.08 v7.87,20.7
  Bottom 0.254: v5.21,20.32 5.71,20.7 v7.87,20.7
JTDO  (via drill 0.6)
  Top 0.254: v9.4,20.07 10.41,21.08 11.68,21.08 11.94,21.34 11.94,22.23 U1.55
  Bottom 0.254: JTAG.6 7.94,19.11 8.89,20.07 v9.4,20.07
JTMS  (via drill 0.6)
  Top 0.254: v8.76,25.15 8.72,25.19 U1.46
  Bottom 0.254: JTAG.2 4.92,23.11 U1.46 8.72,25.19 v8.76,25.15
LED1  (via drill 0.6)
  Top 0.254: U1.3 19.39,25.19 v20.32,24.26 | v20.45,15.75 24.52,11.67 LED1.C
  Bottom 0.254: v20.32,24.26 20.45,24.13 v20.45,15.75
LED2  (via drill 0.6)
  Top 0.254: U1.4 24.35,25.69 31.62,18.41 31.62,17.78 v32.51,16.89 | v35.94,13.97 33.66,11.68 29.86,11.68 LED2.C
  Bottom 0.254: v32.51,16.89 33.78,16.89 35.94,14.73 v35.94,13.97
N$1
  Top 0.406: M1-.P$1 1.27,11.43 C7.1
  Top 0.813: Q2.3 Q1.3 5.25,10.67 3.68,10.67 2.92,11.43 M1-.P$1
N$2
  Top 0.406: C8.1 47.24,11.01 M2-.P$1
  Top 0.813: Q4.3 43.01,10.79 | C8.1 46.65,11.01 | 43.01,10.79 Q3.3 | 43.01,10.79 45.21,10.79 45.72,11.3 47.12,11.3 M2-.P$1
N$3
  Top 0.813: C9.1 46.99,37.08 M3-.P$1 45.72,36.83 45.09,37.47 43.01,37.47 Q5.3 Q6.3
N$4
  Top 0.813: C10.1 1.27,37.08 M4-.P$1 2.67,36.83 3.43,37.59 5.25,37.59 Q7.3 Q8.3
N$5
  Top 0.254: R4.2 R10.1
  Top 0.305: 39.88,13.72 40.84,13.72 Q3.1 | R10.1 R3.2
  Top 0.406: R3.2 38.95,12.79 39.88,13.72 | Q4.1 39.27,9.84 R10.1
N$6
  Top 0.406: Q5.1 40.84,36.58 40.13,36.58 38.95,37.76 R5.2 R20.1 39.14,40.32 | 39.14,40.32 Q6.1 | 39.14,40.32 38.95,40.51 R6.2
N$7
  Top 0.305: Q7.1 7.35,34.87 R7.2
  Top 0.406: R21.1 8.87,38.42 Q8.1 | R7.2 R21.1 | R21.1 R8.2
N$8
  Top 0.406: Q1.1 8.05,12.45 9.31,12.45 R1.2 R9.1 R2.2 8.99,7.94 Q2.1
N$9
  Top 0.61: C3.1 15.02,7.62 PAM3101_1.4
N$10
  Top 0.254: Q9.1 11.68,18.03 16,18.03 17.14,19.18 17.14,23.24 16.76,23.62 16.76,26.04 17.42,26.69 U1.6 | 12.7,13.12 C23.1
  Top 0.305: 12.7,13.12 12.7,14.22 11.94,14.99 11.3,14.99 10.41,15.88 Q9.1
N$11  (via drill 0.6)
  Top 0.254: v5.33,29.84 5.33,30.77 C34.1 | U1.7 18.39,27.18 17.14,27.18 15.75,25.78 11.94,25.78 9.4,28.32 v9.4,28.96
  Bottom 0.254: v5.33,29.84 6.22,28.96 v9.4,28.96
N$12  (via drill 0.6)
  Top 0.254: v13.72,24.26 14.45,23.52 U1.60
  Bottom 0.254: v13.72,24.26 12.91,24.26 R22.1 12.19,24.85 12.19,25.15 11.68,25.65 10.79,25.65 8.89,27.56 5.42,27.56 R23.1
N$13  (via drill 0.6)
  Top 0.254: v27.81,8.89 LED1.A
  Bottom 0.254: R24.2 v27.81,8.89
N$14
  Top 0.61: C5.1 30.92,40.85 PAM3101_2.4
N$15
  Top 0.254: Q9.2 17.65,18.92 17.65,23.5 17.27,23.88 17.27,25.78 17.68,26.19 U1.5 | C22.1 16.26,13.12
  Top 0.305: 16.26,13.12 16.13,13.25 16.13,13.84 15.49,14.48 Q9.2
N$16  (via drill 0.6)
  Top 0.254: v29.84,8.89 29.86,10.03 LED2.A
  Bottom 0.254: R25.2 29.88,10.03 v29.84,8.89
N$17
  Top 0.254: R26.2 19.66,4.36 LED3.A
N$18
  Top 0.254: R14.2 42.66,20.32 LED4.A
N$19
  Top 0.406: U$1.8 42.58,27.71 C13.2
N$20  (via drill 0.7)
  Top 0.406: U$1.9 41.83,28.37 42.16,28.7 v42.16,32
  Bottom 0.305: C16.2 33,27.07 | C15.2 33.91,27.99 33.88,27.96
  Bottom 0.406: JP9.2 33,27.07 33.88,27.96 37.85,32 v42.16,32
N$21
  Bottom 0.254: R15.1 39.55,19.52 R16.1
PWM1
  Top 0.254: R1.1 11.01,12.83 10.38,13.46 9.27,13.46 8.13,14.61 7.24,14.61 6.35,15.49 6.35,22.86 7.11,23.62 7.75,23.62 8.26,24.13 9.14,24.13 9.65,24.64 9.65,26.29 8.26,27.69 U1.41
  Top 0.305: U1.41
  Top 0.406: R9.2 R1.1
PWM2
  Top 0.254: U1.15 20.9,31.19 22.23,32.51 22.23,34.42 22.99,35.18 34.54,35.18 35.18,34.54 35.18,33.02 33.27,31.11 28.83,31.11 26.29,28.57 26.29,25.53 37.25,14.57 R3.1 37.21,12.48
  Top 0.406: R10.2 R3.1
PWM3  (via drill 0.6)
  Top 0.254: U1.27 11.43,33.66 11.43,34.54 11.68,34.8 12.7,34.8 13.72,35.81 13.72,37.72 14.22,38.23 26.54,38.23 v27.56,37.21 | R5.1 37,38.1 | R5.1 36.87,38.23 | v31.5,37.72 37.12,37.72 R5.1
  Top 0.406: R5.1 R20.2
  Bottom 0.254: v27.56,37.21 30.99,37.21 v31.5,37.72
PWM4
  Top 0.254: 11.01,36.66 10.16,35.81 9.14,35.81 8.38,35.05 8.38,28.45 11.56,25.27 14.22,25.27 14.73,24.77 14.73,24 15.45,23.29 U1.62
  Top 0.305: 11.01,36.66 R7.1
  Top 0.406: R7.1 R21.2
PWR_CHECK  (via drill 0.6)
  Top 0.254: v25.78,40.39 R31.1 | v15.88,31.88 14.95,32.8 U1.20
  Top 0.406: R31.1 R30.2
  Bottom 0.254: v25.78,40.39 25.78,38.61 21.97,34.8 18.29,34.8 C35.2 18.29,34.42 17.53,34.42 17.02,33.91 17.02,32.38 16.51,31.88 v15.88,31.88
RX-I
  Top 0.254: JBLUETOOTH.3 2.03,30.99 5.46,27.56 5.46,27.05 5.84,26.67 6.98,26.67 U1.43
TX-O
  Top 0.254: 2.03,33.53 3.3,32.26 3.3,30.48 5.97,27.81 5.97,27.3 6.1,27.18 6.99,27.18 U1.42
  Top 0.406: 2.03,33.53 JBLUETOOTH.4
VCC  (1 unrouted)
  Top 0: C8.2 46.74,9.4 46.61,9.53 | 46.61,9.53 46.61,9.02 | 46.61,9.53 47.21,9.04 47.24,9.02
  Top 0.254: 27.56,44.32 27.69,44.2 | C37.A 12.7,42.8 | C36.A 34.67,6.35 | PAM3101_1.3 14.92,2.61 14.99,2.54 | PAM3101_2.3 31.43,45.53 31.62,45.72
  Top 0.406: C7.2 1.02,9.31 M1+.P$1 | C1.A 27.94,5.33 27.94,6.1 | C11.A 20.32,42.93 20.32,42.42 | PWR2.1 12.45,45.72 JP6.P$1 | JP5.P$1 35.56,0.25 PWR1.1 | 27.56,45.72 27.56,44.32 R30.1
  Top 0.61: 31.24,45.72 31.31,45.65 | 14.73,2.54 14.92,2.73 | C2.1 12.92,4.83 PAM3101_1.1 13.02,2.73 12.83,2.54 | 31.11,45.72 31.43,45.4 | 33.27,45.72 33.34,45.66 PAM3101_2.1 34.87,43.97 C14.1
  Top 0.813: M4+.P$1 1.27,39.12 C10.2 | C9.2 47.24,39.2 M3+.P$1
  Top 1.016: 46.61,8.51 46.61,8.64 | 46.74,8.89 46.89,9.04 47.21,9.04
  Top 1.27: 46.61,8.64 46.74,8.89 M2+.P$1 | M1+.P$1 1.27,8.89 2.54,7.62 arc-90 7.62,2.54 12.83,2.54 14.73,2.54 14.99,2.54 27.94,2.54 27.94,6.1 27.94,6.35 34.67,6.35 35.56,6.35 PWR1.1 40.64,2.54 arc-90 45.72,7.62 46.61,8.51 | M4+.P$1 1.27,39.37 2.54,40.64 arc90 7.62,45.72 PWR2.1 12.7,42.8 12.7,41.91 20.32,41.91 20.32,42.42 20.32,45.72 27.56,45.72 31.11,45.72 31.24,45.72 31.62,45.72 33.27,45.72 40.64,45.72 arc90 45.72,40.64 46.86,39.5 M3+.P$1
VDDA  (via drill 0.6)
  Top 0.305: IMU_1.1 23.62,32.64 21.17,30.19 U1.13 17.43,30.19 17.27,30.35 v16.26,30.35
  Bottom 0.305: v16.26,30.35 14.9,30.35 C32.1
  Bottom 0.61: IMU_1.1 23.62,35.05 24.13,35.56 IND1.2
VREF_XY  (via drill 0.6)
  Top 0.254: v15.49,27.18 13.95,28.72 U1.22
  Bottom 0.254: IMU_2.4 28.7,17.14 23.37,17.14 22.86,17.65 22.86,25.53 21.21,27.18 v15.49,27.18
VREF_Z  (via drill 0.6)
  Top 0.254: v10.92,29.97 11.43,30.48 11.94,30.48 12.45,30.99 U1.25
  Bottom 0.254: IMU_2.1 21.34,16.89 21.34,24.77 20.83,25.27 13.59,25.27 10.92,27.94 v10.92,29.97

### Text on the board
tPlace: QuadroCopter02 | + | M4+ | M3+ | STM32 | C3 | TX | A3 | RX | A2 | GND | A1 | 3V | RST | IMU | D6 | LED4 | D5 | D4 | SDA | SCL | LED1 | LED2 | M2+ | M1+ | POWER | by Librae | +
bPlace: NC | C4 | C5 | C6 | C7 | short:BOOT0=0 | STM8_PWR | D1 | D2 | 8_RST | D3 | LeafGrass